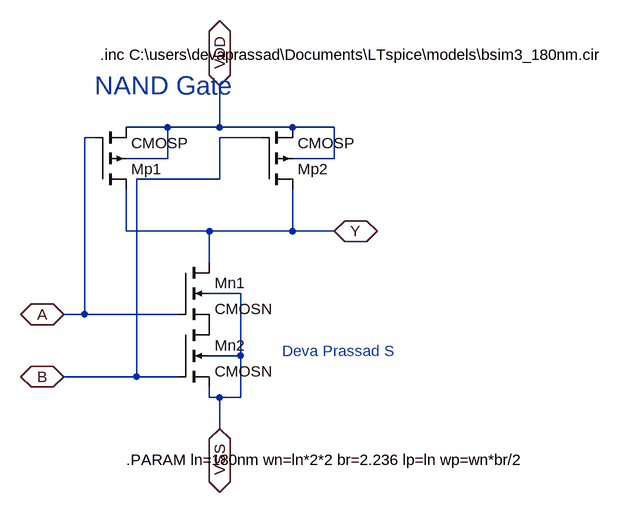
[diagram p0: schematic nand1x.asc]
nand1x.asc, the LTspice schematic file:
Version 4.1
SHEET 1 880 680
WIRE 144 -80 80 -80
WIRE 224 -80 224 -144
WIRE 224 -80 144 -80
WIRE 336 -80 224 -80
WIRE 400 -80 336 -80
WIRE 32 -64 16 -64
WIRE 288 -64 224 -64
WIRE 144 -32 144 -80
WIRE 144 -32 80 -32
WIRE 400 -32 400 -80
WIRE 400 -32 336 -32
WIRE 224 0 224 -64
WIRE 224 0 96 0
WIRE 80 80 80 16
WIRE 208 80 80 80
WIRE 336 80 336 16
WIRE 336 80 208 80
WIRE 400 80 336 80
WIRE 208 128 208 80
WIRE 256 176 208 176
WIRE 16 208 16 -64
WIRE 16 208 -16 208
WIRE 160 208 16 208
WIRE 256 272 256 176
WIRE 256 272 208 272
WIRE 96 304 96 0
WIRE 96 304 -16 304
WIRE 160 304 96 304
WIRE 208 336 208 320
WIRE 224 336 208 336
WIRE 256 336 256 272
WIRE 256 336 224 336
WIRE 224 384 224 336
FLAG 400 80 Y
IOPIN 400 80 BiDir
FLAG -16 208 A
IOPIN -16 208 BiDir
FLAG -16 304 B
IOPIN -16 304 BiDir
FLAG 224 -144 VDD
IOPIN 224 -144 BiDir
FLAG 224 384 VSS
IOPIN 224 384 BiDir
SYMBOL nmos4 160 128 R0
SYMATTR InstName Mn1
SYMATTR Value2 l={ln} w={wn} ad={ln*wn} as={ln*wn} pd={2*ln+wn} ps={2*ln+wn}
SYMATTR Value CMOSN
SYMBOL nmos4 160 224 R0
SYMATTR InstName Mn2
SYMATTR Value2 l={ln} w={wn} ad={ln*wn} as={ln*wn} pd={2*ln+wn} ps={2*ln+wn}
SYMATTR Value CMOSN
SYMBOL pmos4 32 16 M180
SYMATTR InstName Mp1
SYMATTR Value2 l={lp} w={wp} ad={lp*wp} as={lp*wp} pd={2*lp+wp} ps={2*lp+wp}
SYMATTR Value CMOSP
SYMBOL pmos4 288 16 M180
SYMATTR InstName Mp2
SYMATTR Value2 l={lp} w={wp} ad={lp*wp} as={lp*wp} pd={2*lp+wp} ps={2*lp+wp}
SYMATTR Value CMOSP
TEXT 32 -144 Left 4 ;NAND Gate
TEXT 320 264 Left 2 ;Deva Prassad S
TEXT 80 432 Left 2 !.PARAM ln=180nm wn=ln*2*2 br=2.236 lp=ln wp=wn*br/2
TEXT 40 -192 Left 2 !.inc C:\\users\\devaprassad\\Documents\\LTspice\\models\\bsim3_180nm.cir

The netlist it stands for:
* nand1x.asc
Mn1 Y A P001 VSS CMOSN l={ln} w={wn} ad={ln*wn} as={ln*wn} pd={2*ln+wn} ps={2*ln+wn}
Mn2 P001 B VSS VSS CMOSN l={ln} w={wn} ad={ln*wn} as={ln*wn} pd={2*ln+wn} ps={2*ln+wn}
Mp1 Y A VDD VDD CMOSP l={lp} w={wp} ad={lp*wp} as={lp*wp} pd={2*lp+wp} ps={2*lp+wp}
Mp2 Y B VDD VDD CMOSP l={lp} w={wp} ad={lp*wp} as={lp*wp} pd={2*lp+wp} ps={2*lp+wp}
.model NMOS NMOS
.model PMOS PMOS
.lib standard.mos
* NAND Gate
* Deva Prassad S
.PARAM ln=180nm wn=ln*2*2 br=2.236 lp=ln wp=wn*br/2
.inc C:\users\devaprassad\Documents\LTspice\models\bsim3_180nm.cir
.backanno
.end